# Altium schematic sheet 13.SchDoc
size 513 x 386 mm
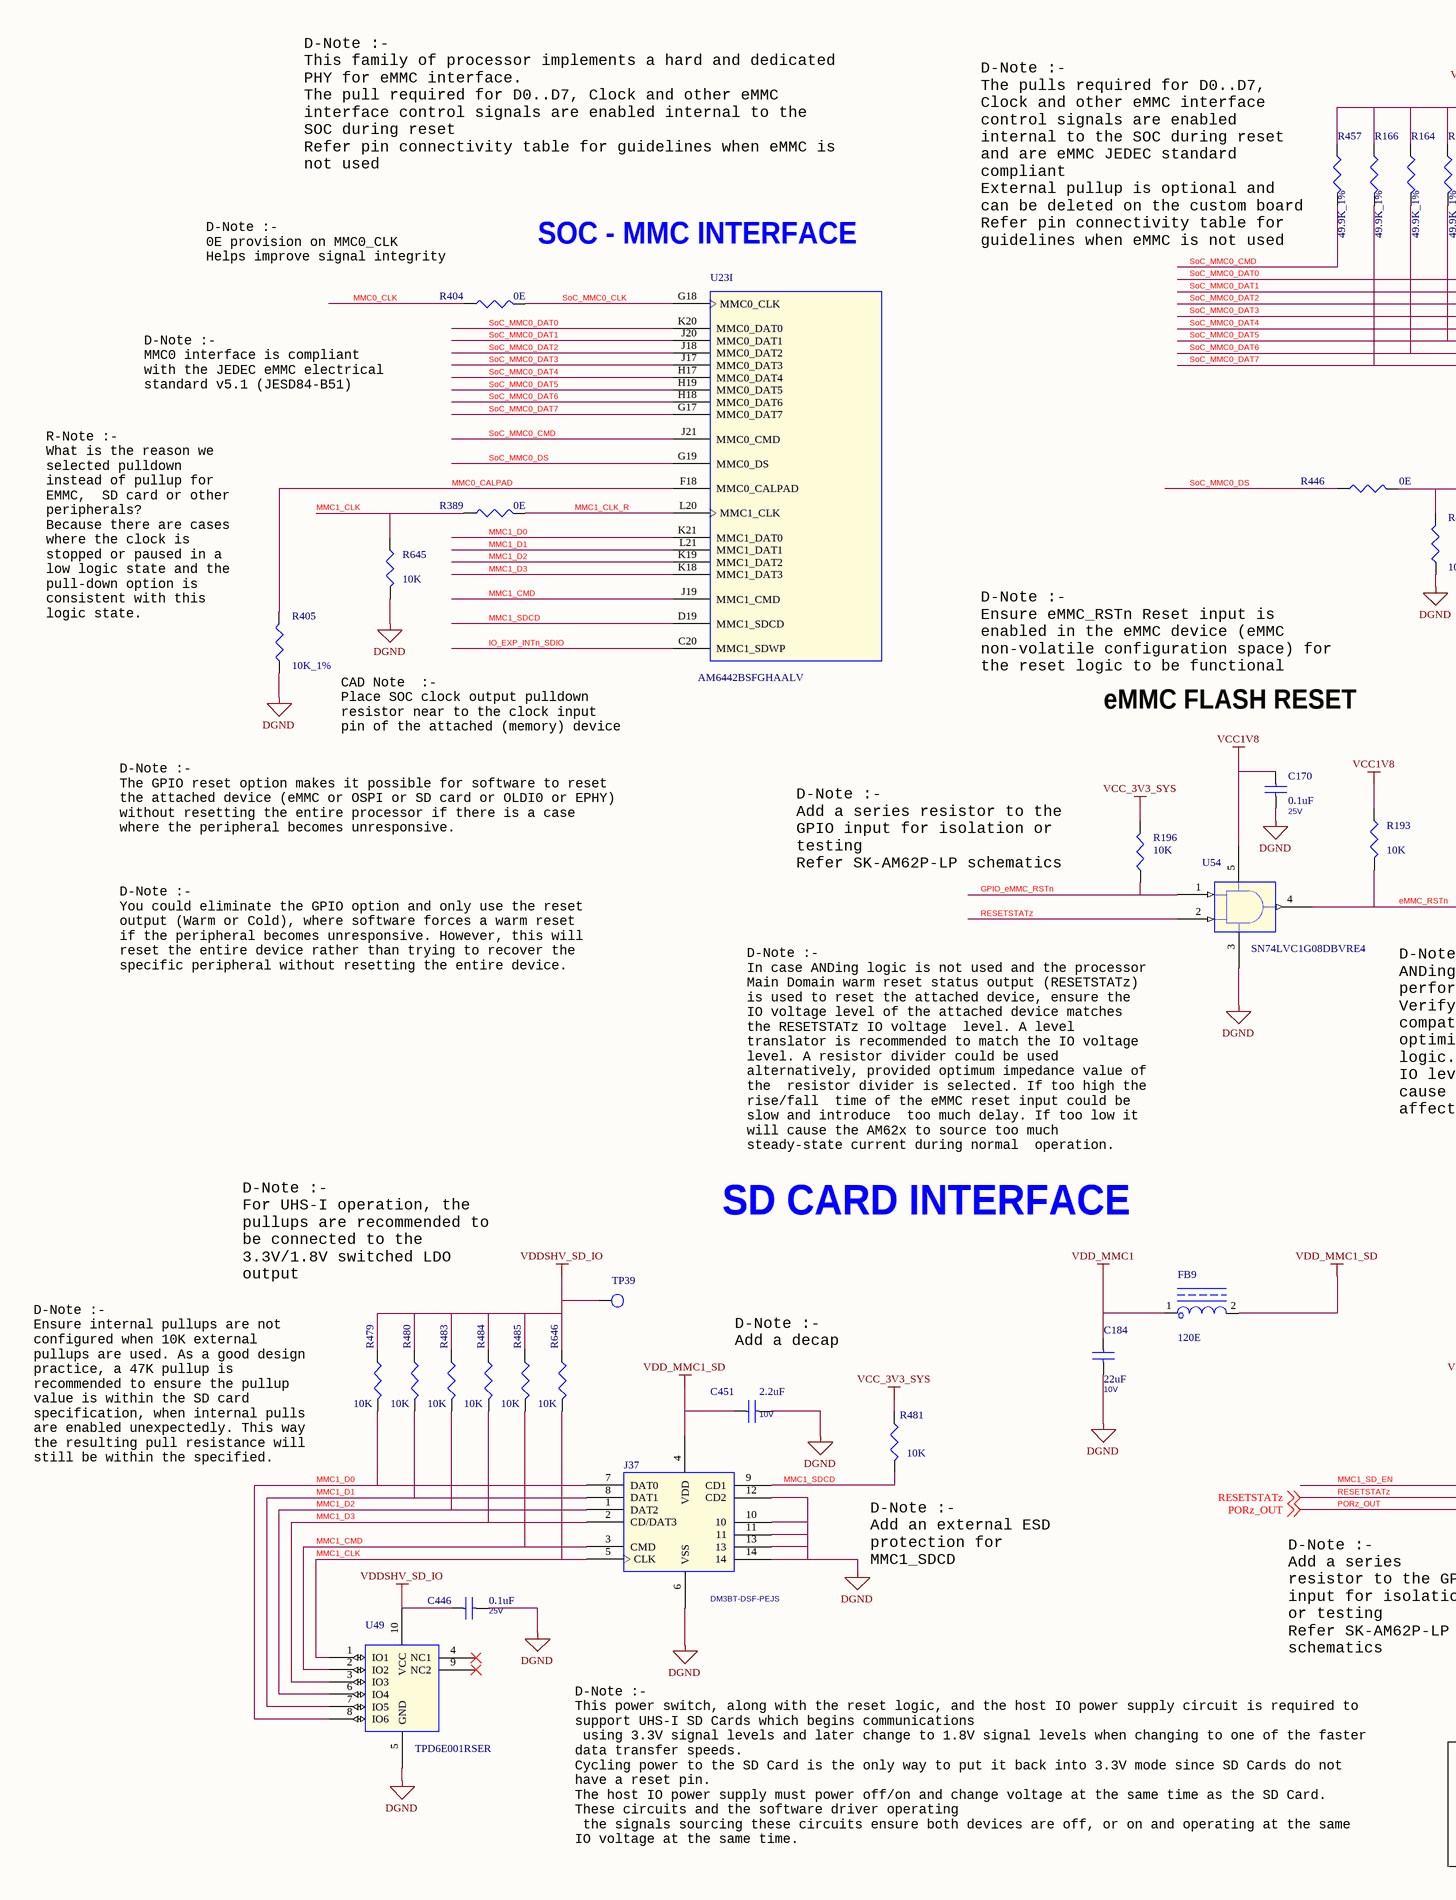
[diagram p0: 13.SchDoc, left]
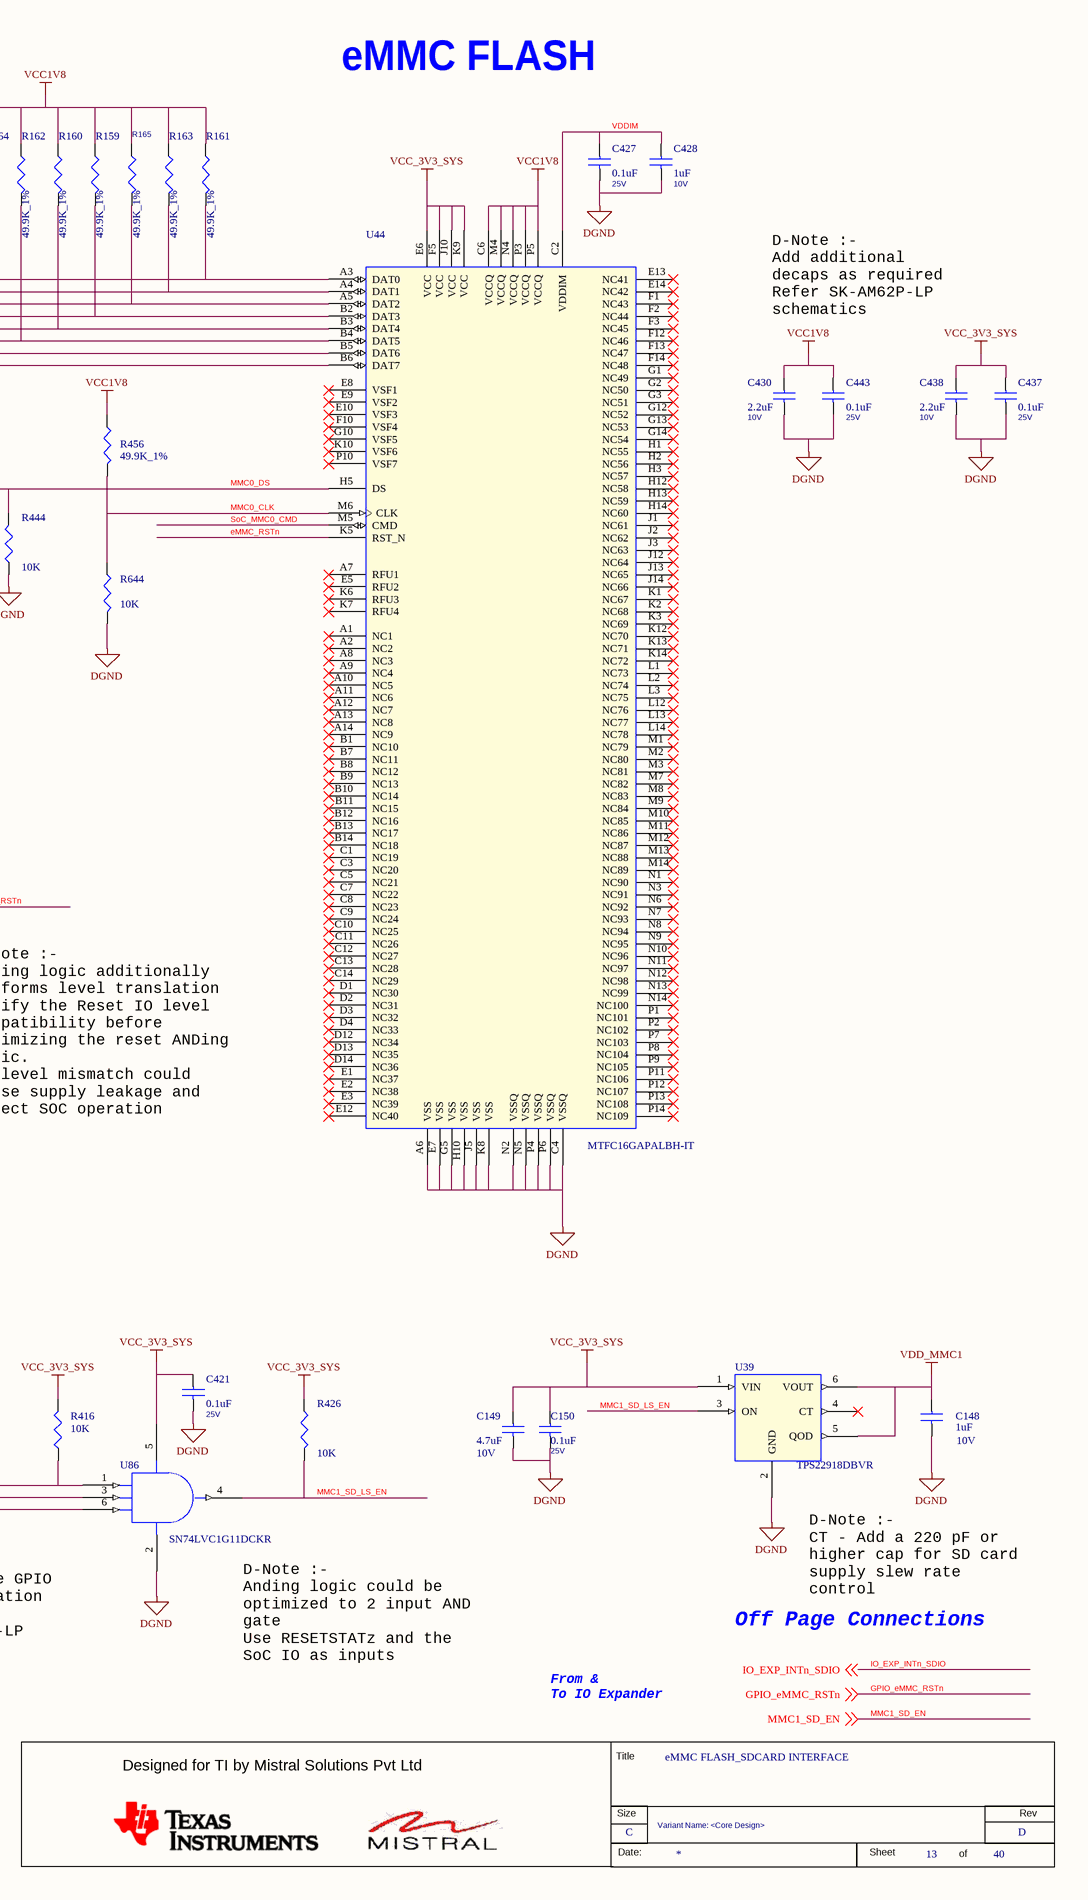
[diagram p1: 13.SchDoc, right]

## Parts
*  RevCode: D  Title: eMMC FLASH_SDCARD INTERFACE  Page Size: C  Page Number: 13  Page Count: 40  Variant Name: <Core Design>  (hidden comment: MISTRAL_TITLEBLK_CSIZE)  (graphical)
C148  1uF  Voltage: 10V  [CAP0402_0-75]
C149  4.7uF  Voltage: 10V  [CAP0402_0-75]
C150  0.1uF  Voltage: 25V  [CAP0402_0-75]
C170  0.1uF  Voltage: 25V  [CAP0402_0-75]
C184  22uF  Voltage: 10V  [CAP0805_1-5]
C421  0.1uF  Voltage: 25V  [CAP0402_0-75]
C427  0.1uF  Voltage: 25V  [CAP0402_0-75]
C428  1uF  Voltage: 10V  [CAP0402_0-75]
C430  2.2uF  Voltage: 10V  [CAP0402_0-75]
C437  0.1uF  Voltage: 25V  [CAP0402_0-75]
C438  2.2uF  Voltage: 10V  [CAP0402_0-75]
C443  0.1uF  Voltage: 25V  [CAP0402_0-75]
C446  0.1uF  Voltage: 25V  [CAP0402_0-75]
C451  2.2uF  Voltage: 10V  [CAP0402_0-75]
FB9  120E  [IND0603_1]
J37  Mfr_part_number: DM3BT-DSF-PEJS  [CON_SD10_DM3BT-DSF-PEJS_S_R_S_2-4]  (hidden comment: CON_SDCARD10_DM3BT-DSF-PEJS)
R159  49.9K_1%  [RES0402_0-5]
R160  49.9K_1%  [RES0402_0-5]
R161  49.9K_1%  [RES0402_0-5]
R162  49.9K_1%  [RES0402_0-5]
R163  49.9K_1%  [RES0402_0-5]
R164  49.9K_1%  [RES0402_0-5]
R165  49.9K_1%  [RES0402_0-5]
R166  49.9K_1%  [RES0402_0-5]
R193  10K  [RES0402_0-5]
R196  10K  [RES0402_0-5]
R389  0E  [RES0402_0-5]
R404  0E  [RES0402_0-5]
R405  10K_1%  [RES0402_0-5]
R416  10K  [RES0402_0-5]
R426  10K  [RES0402_0-5]
R444  10K  [RES0402_0-5]
R446  0E  [RES0402_0-5]
R456  49.9K_1%  [RES0402_0-5]
R457  49.9K_1%  [RES0402_0-5]
R479  10K  [RES0402_0-5]
R480  10K  [RES0402_0-5]
R481  10K  [RES0402_0-5]
R483  10K  [RES0402_0-5]
R484  10K  [RES0402_0-5]
R485  10K  [RES0402_0-5]
R644  10K  [RES0402_0-5]
R645  10K  [RES0402_0-5]
R646  10K  [RES0402_0-5]
TP39  TP20_SMD  [TP20_SMD]  (value not drawn)
U23  AM6442BSFGHAALV  [FCBGA441_31-49_680X680_2-6]  (part I of 16)
U39  TPS22918DBVR  [SOT23-6]
U44  MTFC16GAPALBH-IT  [VFBGA153_19-68_460X520_1-1]
U49  TPD6E001RSER  [UQFN10_19-68_80X60_0-6]
U54  SN74LVC1G08DBVRE4  [SOT23-5]
U86  SN74LVC1G11DCKR  [SC70-6]

## Nets
DGND: C148.2 C149.2 C150.2 C170.2 C184.2 C421.2 C427.2 C428.2 C430.2 C437.2 C438.2 C443.2 C446.2 C451.2 J37.6(VSS) J37.10 J37.11 J37.12(CD2) J37.13 J37.14 R405.2 R444.1 R644.2 R645.2 U39.2(GND) U44.A6(VSS) U44.C4(VSSQ) U44.E7(VSS) U44.G5(VSS) U44.H10(VSS) U44.J5(VSS) U44.K8(VSS) U44.N2(VSSQ) U44.N5(VSSQ) U44.P4(VSSQ) U44.P6(VSSQ) U49.5(GND) U54.3(GND) U86.2(GND)
VCC1V8: C170.1 C430.1 C443.1 R159.1 R160.1 R161.1 R162.1 R163.1 R164.1 R165.1 R166.1 R193.1 R456.1 R457.1 U44.C6(VCCQ) U44.M4(VCCQ) U44.N4(VCCQ) U44.P3(VCCQ) U44.P5(VCCQ) U54.5(VCC)
VCC_3V3_SYS: C149.1 C150.1 C421.1 C437.1 C438.1 R196.2 R416.2 R426.1 R481.1 U39.1(VIN) U44.E6(VCC) U44.F5(VCC) U44.J10(VCC) U44.K9(VCC) U86.5(VCC)
VDD_MMC1: C148.1 C184.1 FB9.1 U39.5(QOD) U39.6(VOUT)
VDD_MMC1_SD: C451.1 FB9.2 J37.4(VDD)
VDDSHV_SD_IO: C446.1 R479.1 R480.1 R483.1 R484.1 R485.1 R646.1 TP39.1(TP) U49.10(VCC)
eMMC_RSTn: R193.2 U44.K5(RST_N) U54.4(Y)
GPIO_eMMC_RSTn: R196.1 U54.1(A) ; off-sheet GPIO_eMMC_RSTn
IO_EXP_INTn_SDIO: U23.C20(MMC1_SDWP) ; off-sheet IO_EXP_INTn_SDIO
MMC0_CALPAD: R405.1 U23.F18(MMC0_CALPAD)
MMC0_CLK: R404.1 R456.2 R644.1 U44.M6(CLK)
MMC0_DS: R444.2 R446.2 U44.H5(DS)
MMC1_CLK: J37.5(CLK) R389.1 R645.1 R646.2 U49.1(IO1)
MMC1_CLK_R: R389.2 U23.L20(MMC1_CLK)
MMC1_CMD: J37.3(CMD) R485.2 U23.J19(MMC1_CMD) U49.2(IO2)
MMC1_D0: J37.7(DAT0) R479.2 U23.K21(MMC1_DAT0) U49.8(IO6)
MMC1_D1: J37.8(DAT1) R480.2 U23.L21(MMC1_DAT1) U49.7(IO5)
MMC1_D2: J37.1(DAT2) R483.2 U23.K19(MMC1_DAT2) U49.6(IO4)
MMC1_D3: J37.2(CD/DAT3) R484.2 U23.K18(MMC1_DAT3) U49.3(IO3)
MMC1_SD_EN: R416.1 U86.1(A) ; off-sheet MMC1_SD_EN
MMC1_SD_LS_EN: R426.2 U39.3(ON) U86.4(Y)
MMC1_SDCD: J37.9(CD1) R481.2 U23.D19(MMC1_SDCD)
PORz_OUT: U86.6(C) ; off-sheet PORz_OUT
RESETSTATz: U54.2(B) U86.3(B) ; off-sheet RESETSTATz
SoC_MMC0_CLK: R404.2 U23.G18(MMC0_CLK)
SoC_MMC0_CMD: R457.2 U23.J21(MMC0_CMD) U44.M5(CMD)
SoC_MMC0_DAT0: R161.2 U23.K20(MMC0_DAT0) U44.A3(DAT0)
SoC_MMC0_DAT1: R163.2 U23.J20(MMC0_DAT1) U44.A4(DAT1)
SoC_MMC0_DAT2: R165.2 U23.J18(MMC0_DAT2) U44.A5(DAT2)
SoC_MMC0_DAT3: R159.2 U23.J17(MMC0_DAT3) U44.B2(DAT3)
SoC_MMC0_DAT4: R160.2 U23.H17(MMC0_DAT4) U44.B3(DAT4)
SoC_MMC0_DAT5: R162.2 U23.H19(MMC0_DAT5) U44.B4(DAT5)
SoC_MMC0_DAT6: R164.2 U23.H18(MMC0_DAT6) U44.B5(DAT6)
SoC_MMC0_DAT7: R166.2 U23.G17(MMC0_DAT7) U44.B6(DAT7)
SoC_MMC0_DS: R446.1 U23.G19(MMC0_DS)
VDDIM: C427.1 C428.1 U44.C2(VDDIM)

Not connected (* = marked no-connect by the designer): U39 4(CT)*; U44 A1(NC1)* A2(NC2)* A7(RFU1)* A8(NC3)* A9(NC4)* A10(NC5)* A11(NC6)* A12(NC7)* A13(NC8)* A14(NC9)* B1(NC10)* B7(NC11)* B8(NC12)* B9(NC13)* B10(NC14)* B11(NC15)* B12(NC16)* B13(NC17)* B14(NC18)* C1(NC19)* C3(NC20)* C5(NC21)* C7(NC22)* C8(NC23)* C9(NC24)* C10(NC25)* C11(NC26)* C12(NC27)* C13(NC28)* C14(NC29)* D1(NC30)* D2(NC31)* D3(NC32)* D4(NC33)* D12(NC34)* D13(NC35)* D14(NC36)* E1(NC37)* E2(NC38)* E3(NC39)* E5(RFU2)* E8(VSF1)* E9(VSF2)* E10(VSF3)* E12(NC40)* E13(NC41)* E14(NC42)* F1(NC43)* F2(NC44)* F3(NC45)* F10(VSF4)* F12(NC46)* F13(NC47)* F14(NC48)* G1(NC49)* G2(NC50)* G3(NC51)* G10(VSF5)* G12(NC52)* G13(NC53)* G14(NC54)* H1(NC55)* H2(NC56)* H3(NC57)* H12(NC58)* H13(NC59)* H14(NC60)* J1(NC61)* J2(NC62)* J3(NC63)* J12(NC64)* J13(NC65)* J14(NC66)* K1(NC67)* K2(NC68)* K3(NC69)* K6(RFU3)* K7(RFU4)* K10(VSF6)* K12(NC70)* K13(NC71)* K14(NC72)* L1(NC73)* L2(NC74)* L3(NC75)* L12(NC76)* L13(NC77)* L14(NC78)* M1(NC79)* M2(NC80)* M3(NC81)* M7(NC82)* M8(NC83)* M9(NC84)* M10(NC85)* M11(NC86)* M12(NC87)* M13(NC88)* M14(NC89)* N1(NC90)* N3(NC91)* N6(NC92)* N7(NC93)* N8(NC94)* N9(NC95)* N10(NC96)* N11(NC97)* N12(NC98)* N13(NC99)* N14(NC100)* P1(NC101)* P2(NC102)* P7(NC103)* P8(NC104)* P9(NC105)* P10(VSF7)* P11(NC106)* P12(NC107)* P13(NC108)* P14(NC109)*; U49 4(NC1)* 9(NC2)*

## Notes on the sheet
- D-Note :-
  This family of processor implements a hard and dedicated
  PHY for eMMC interface.
  The pull required for D0..D7, Clock and other eMMC
  interface control signals are enabled internal to the
  SOC during reset
  Refer pin connectivity table for guidelines when eMMC is
  not used
- (near R457) D-Note :-
  The pulls required for D0..D7,
  Clock and other eMMC interface
  control signals are enabled
  internal to the SOC during reset
  and are eMMC JEDEC standard
  compliant
  External pullup is optional and
  can be deleted on the custom board
  Refer pin connectivity table for
  guidelines when eMMC is not used
- eMMC FLASH
- (near R404) D-Note :-
  0E provision on MMC0_CLK
  Helps improve signal integrity
- D-Note :-
  Add additional
  decaps as required
  Refer SK-AM62P-LP
  schematics
- SOC - MMC INTERFACE
- D-Note :-
  MMC0 interface is compliant
  with the JEDEC eMMC electrical
  standard v5.1 (JESD84-B51)
- (near R405) R-Note :-
  What is the reason we
  selected pulldown
  instead of pullup for
  EMMC,  SD card or other
  peripherals?
  Because there are cases
  where the clock is
  stopped or paused in a
  low logic state and the
  pull-down option is
  consistent with this
  logic state.
- D-Note :-
  Ensure eMMC_RSTn Reset input is
  enabled in the eMMC device (eMMC
  non-volatile configuration space) for
  the reset logic to be functional
- CAD Note  :-
  Place SOC clock output pulldown
  resistor near to the clock input
  pin of the attached (memory) device
- eMMC FLASH RESET
- D-Note :-
  The GPIO reset option makes it possible for software to reset
  the attached device (eMMC or OSPI or SD card or OLDI0 or EPHY)
  without resetting the entire processor if there is a case
  where the peripheral becomes unresponsive.
- D-Note :-
  Add a series resistor to the
  GPIO input for isolation or
  testing
  Refer SK-AM62P-LP schematics
- D-Note :-
  You could eliminate the GPIO option and only use the reset
  output (Warm or Cold), where software forces a warm reset
  if the peripheral becomes unresponsive. However, this will
  reset the entire device rather than trying to recover the
  specific peripheral without resetting the entire device.
- (near U54) D-Note :-
  In case ANDing logic is not used and the processor
  Main Domain warm reset status output (RESETSTATz)
  is used to reset the attached device, ensure the
  IO voltage level of the attached device matches
  the RESETSTATz IO voltage  level. A level
  translator is recommended to match the IO voltage
  level. A resistor divider could be used
  alternatively, provided optimum impedance value of
  the  resistor divider is selected. If too high the
  rise/fall  time of the eMMC reset input could be
  slow and introduce  too much delay. If too low it
  will cause the AM62x to source too much
  steady-state current during normal  operation.
- D-Note :-
  ANDing logic additionally
  performs level translation
  Verify the Reset IO level
  compatibility before
  optimizing the reset ANDing
  logic.
  IO level mismatch could
  cause supply leakage and
  affect SOC operation
- D-Note :-
  For UHS-I operation, the
  pullups are recommended to
  be connected to the
  3.3V/1.8V switched LDO
  output
- SD CARD INTERFACE
- (near R479) D-Note :-
  Ensure internal pullups are not
  configured when 10K external
  pullups are used. As a good design
  practice, a 47K pullup is
  recommended to ensure the pullup
  value is within the SD card
  specification, when internal pulls
  are enabled unexpectedly. This way
  the resulting pull resistance will
  still be within the specified.
- D-Note :-
  Add a decap
- (near R481) D-Note :-
  Add an external ESD
  protection for
  MMC1_SDCD
- D-Note :-
  Add a series
  resistor to the GPIO
  input for isolation
  or testing
  Refer SK-AM62P-LP
  schematics
- D-Note :-
  CT - Add a 220 pF or
  higher cap for SD card
  supply slew rate
  control
- (near U86) D-Note :-
  Anding logic could be
  optimized to 2 input AND
  gate
  Use RESETSTATz and the
  SoC IO as inputs
- Off Page Connections
- (near *) D-Note :-
  This power switch, along with the reset logic, and the host IO power supply circuit is required to
  support UHS-I SD Cards which begins communications
  using 3.3V signal levels and later change to 1.8V signal levels when changing to one of the faster
  data transfer speeds.
  Cycling power to the SD Card is the only way to put it back into 3.3V mode since SD Cards do not
  have a reset pin.
  The host IO power supply must power off/on and change voltage at the same time as the SD Card.
  These circuits and the software driver operating
  the signals sourcing these circuits ensure both devices are off, or on and operating at the same
  IO voltage at the same time.
- From &
  To IO Expander
- (in symbol MISTRAL_TITLEBLK_CSIZE) Title; Designed for TI by Mistral Solutions Pvt Ltd; Size; Rev; Date:; Sheet; of

## Library data of the parts
* = MISTRAL_TITLEBLK_CSIZE: Issue: 1.0; Page Create Date: March  8, 1995; Page Modify Date: *
C148 = CAP_Dup3: CAP CERAMIC 1uF 10V 20% X5R 0402; Part_type: CAPACITORS\CERAMIC; Mfr_part_number: 885012105012; Mfr_name: WURTH ELECTRONICS; Mistral Part No: 120020080009-R; Custom_Duty: 15%; Customs_HS_Code: 85322990; Wattage: NA; Project: AM64x_EVM_BRD; PCB Footprint: CAP0402_0-75; Footprint Path: Y:\MIS_DATABASE\Library\ALTIUM_TOOL\PCB_FOOTPRINTS\Altium_Footprint_Lib.PcbLib; Library Path: Y:\MIS_DATABASE\Library\ALTIUM_TOOL\SCHEMATICS_PARTS\MS_DISCRETE_Library.schlib; Footprint Ref: CAP0402_0-75; Library Ref: CAP; MECHANICAL 3D STEP FILE: CAP0402_0-75; Chkd/date: MANIRAJA/210820; Crtd /date: ALVY/190820; Datasheet: Y:\MIS_DATABASE\DATASHEETS\CAPACITORS\885012105012.PDF; Temperature: -55癈+85癈; Weight: 0.65mg; Height: 0.55MM; Distributor_part_number: 732-7489-1-ND; Distributor_name: DIGIKEY; Package: 0402; Tolerance: 20%
C149 = CAP_Dup3: CAP CERAMIC 4.7uF 10V 20% X5R 0402; Mistral Part No: 120012060002-R; Mfr_name: MURATA; Mfr_part_number: GRM155R61A475MEAAD; Part_type: CAPACITORS\CERAMIC; Project: TI_J7SVB_PCIE_ADD-ON-CARD; Wattage: NA; Customs_HS_Code: 85322990; Custom_Duty: 15%; PCB Footprint: CAP0402_0-75; Footprint Ref: CAP0402_0-75; Tolerance: 20%; Package: 0402; Distributor_name: DIGIKEY; Distributor_part_number: 490-14306-1-ND; Library Ref: CAP; Height: 0.65MM; Weight: 14mg; Temperature: -55癈+85癈; Datasheet: Y:\MIS_DATABASE\DATASHEETS\CAPACITORS\GRM155R61A475MEAAD.PDF; Crtd /date: ALVY/110718; Chkd/date: MANIRAJA/110718; MECHANICAL 3D STEP FILE: CAP0402_0-75; Library Path: Y:\MIS_DATABASE\Library\ALTIUM_TOOL\SCHEMATICS_PARTS\MS_DISCRETE_Library.schlib; Footprint Path: Y:\MIS_DATABASE\Library\ALTIUM_TOOL\PCB_FOOTPRINTS\Altium_Footprint_Lib.PcbLib
C150 C170 C421 C427 C437 C443 C446 = CAP_Dup3: CAP CERAMIC 0.1uF 25V 20% X5R 0402; Alt_Mfr_part_number: CC0402KRX5R8BB104; Mistral Part No: 120020080003-R; Mfr_name: WURTH ELECTRONICS; Mfr_part_number: 885012105018; Part_type: CAPACITORS\CERAMIC; Alt_Mfr_name: YAGEO AMERICA; Project: AM64x_EVM_BRD; Wattage: NA; Customs_HS_Code: 85322990; Custom_Duty: 15%; PCB Footprint: CAP0402_0-75; Tolerance: 20%; Package: 0402; Distributor_name: DIGIKEY; Distributor_part_number: 732-7495-1-ND; Height: 0.55MM; Weight: 0.65mg; Temperature: -55癈+85癈; Datasheet: Y:\MIS_DATABASE\DATASHEETS\CAPACITORS\885012105018.PDF; Crtd /date: ALVY/170820; Chkd/date: MANIRAJA/170820; MECHANICAL 3D STEP FILE: CAP0402_0-75; Library Ref: CAP; Footprint Ref: CAP0402_0-75; Library Path: Y:\MIS_DATABASE\Library\ALTIUM_TOOL\SCHEMATICS_PARTS\MS_DISCRETE_Library.schlib; Footprint Path: Y:\MIS_DATABASE\Library\ALTIUM_TOOL\PCB_FOOTPRINTS\Altium_Footprint_Lib.PcbLib
C184 = CAP_Dup3: CAP CERAMIC 22uF 10V 20% X5R 0805; Mistral Part No: 120020080010-R; Mfr_name: WURTH ELECTRONICS; Mfr_part_number: 885012107011; Part_type: CAPACITORS\CERAMIC; Project: AM64x_EVM_BRD; Wattage: NA; Customs_HS_Code: 85322990; Custom_Duty: 15%; PCB Footprint: CAP0805_1-5; Footprint Path: Y:\MIS_DATABASE\Library\ALTIUM_TOOL\PCB_FOOTPRINTS\Altium_Footprint_Lib.PcbLib; Library Path: Y:\MIS_DATABASE\Library\ALTIUM_TOOL\SCHEMATICS_PARTS\MS_DISCRETE_Library.schlib; Footprint Ref: CAP0805_1-5; Tolerance: 20%; Package: 0805; Distributor_name: DIGIKEY; Distributor_part_number: 732-7621-1-ND; Library Ref: CAP; Height: 1.45MM; Weight: 5.5mg; Temperature: -55癈+85癈; Datasheet: Y:\MIS_DATABASE\DATASHEETS\CAPACITORS\885012107011.PDF; Crtd /date: ALVY/190820; Chkd/date: MANIRAJA/210820; MECHANICAL 3D STEP FILE: CAP0805_1-5
C428 = CAP_Dup3: CAP CERAMIC 1uF 10V 20% X5R 0402; Part_type: CAPACITORS\CERAMIC; Mfr_part_number: 885012105012; Mfr_name: WURTH ELECTRONICS; Mistral Part No: 120020080009-R; Custom_Duty: 15%; Customs_HS_Code: 85322990; Project: AM64x_EVM_BRD; Wattage: NA; PCB Footprint: CAP0402_0-75; Footprint Ref: CAP0402_0-75; Library Ref: CAP; Chkd/date: MANIRAJA/210820; Crtd /date: ALVY/190820; Datasheet: Y:\MIS_DATABASE\DATASHEETS\CAPACITORS\885012105012.PDF; Temperature: -55癈+85癈; Weight: 0.65mg; Height: 0.55MM; Distributor_part_number: 732-7489-1-ND; Distributor_name: DIGIKEY; Package: 0402; Tolerance: 20%; MECHANICAL 3D STEP FILE: CAP0402_0-75; Library Path: Y:\MIS_DATABASE\Library\ALTIUM_TOOL\SCHEMATICS_PARTS\MS_DISCRETE_Library.schlib; Footprint Path: Y:\MIS_DATABASE\Library\ALTIUM_TOOL\PCB_FOOTPRINTS\Altium_Footprint_Lib.PcbLib
C430 C438 C451 = CAP_Dup3: CAP CERAMIC 2.2uF 10V 20% X5R 0402; Mistral Part No: 120019040036-R; Mfr_name: WURTH ELECTRONICS; Mfr_part_number: 885012105013; Part_type: CAPACITORS\CERAMIC; Project: AM64x_EVM_BRD; Wattage: NA; Customs_HS_Code: 85322990; Custom_Duty: 15%; PCB Footprint: CAP0402_0-75; Library Ref: CAP; Tolerance: 20%; Package: 0402; Distributor_name: DIGIKEY; Distributor_part_number: 732-7490-1-ND; Height: 0.55MM; Weight: 0.65mg; Temperature: -55癈+85癈; Datasheet: Y:\MIS_DATABASE\DATASHEETS\CAPACITORS\885012105013.PDF; Crtd /date: ALVY/170820; Chkd/date: MANIRAJA/170820; MECHANICAL 3D STEP FILE: CAP0402_0-75; Footprint Ref: CAP0402_0-75; Library Path: Y:\MIS_DATABASE\Library\ALTIUM_TOOL\SCHEMATICS_PARTS\MS_DISCRETE_Library.schlib; Footprint Path: Y:\MIS_DATABASE\Library\ALTIUM_TOOL\PCB_FOOTPRINTS\Altium_Footprint_Lib.PcbLib
FB9 = INDUCTOR_FERRITE: IND FERRITE BEAD CHIP 120E 2A 0603; Mfr_part_number: 782631141; Mfr_name: WURTH ELECTRONICS; Mistral Part No: 130020080015-R; Custom_Duty: 24%; Customs_HS_Code: 85437099; Wattage: NA; Tolerance: 25%; Project: AM64x_EVM_BRD; PCB Footprint: IND0603_1; Footprint Path: Y:\MIS_DATABASE\Library\ALTIUM_TOOL\PCB_FOOTPRINTS\Altium_Footprint_Lib.PcbLib; Library Path: Y:\MIS_DATABASE\Library\ALTIUM_TOOL\SCHEMATICS_PARTS\MS_FILTER_Library.schlib; MECHANICAL 3D STEP FILE: IND0603_1; Chkd/date: MANIRAJA/180820; Crtd /date: ALVY/180820; Datasheet: Y:\MIS_DATABASE\DATASHEETS\DISCRETES\INDUCTORS\782631141.PDF; Temperature: -55癈+125癈; Weight: NA; Height: 1.00MM; Library Ref: INDUCTOR_FERRITE; Distributor_part_number: 732-782631141CT-ND; Distributor_name: DIGIKEY; Package: 0603; Voltage: NA; Part_type: INDUCTOR; Footprint Ref: IND0603_1
J37 = CON_SDCARD_10_DM3BT-DSF-PEJS: CON MICROSD CARD PUSH-PUSH 10POS FEMALE RM RA SMD; Mistral Part No: 150011010020-R; Mfr_name: HIROSE ELECTRIC; Part_type: CONNECTOR\MEMORY CARD; Project: EBOOK; Tolerance: NA; Customs_HS_Code: 85369090; Custom_Duty: 24%; PCB Footprint: CON_SD10_DM3BT-DSF-PEJS_S_R_S_2-4; Footprint Ref: CON_SD10_DM3BT-DSF-PEJS_S_R_S_2-4; Voltage: NA; Wattage: NA; Package: SMD; Distributor_name: DIGIKEY; Distributor_part_number: HR1942CT-ND; Library Ref: CON_SDCARD_10_DM3BT-DSF-PEJS; Height: 2.38MM; Weight: 1.315g; Temperature: -25癈+85癈; Datasheet: Y:\MIS_DATABASE\DATASHEETS\CONNECTORS\DM3-SERIES.PDF; Crtd /date: BAVISH/190111; Chkd/date: MANIRAJA/080218; MECHANICAL 3D STEP FILE: CON_SD10_DM3BT-DSF-PEJS_S_R_S_2-4; Library Path: Y:\MIS_DATABASE\Library\ALTIUM_TOOL\SCHEMATICS_PARTS\MS_CONNECTOR_Library.schlib; Footprint Path: Y:\MIS_DATABASE\Library\ALTIUM_TOOL\PCB_FOOTPRINTS\Altium_Footprint_Lib.PcbLib
R159-R164 R166 R456 R457 = RESISTOR_Dup6: RES 49.9K 1/16W 1% 0402; Part_type: RESISTORS\FIXED; Mfr_part_number: RC0402FR-0749K9L; Mfr_name: YAGEO AMERICA; Mistral Part No: 110009030902-R; Voltage: NA; Custom_Duty: 15%; Customs_HS_Code: 85332119; Project: PNAV; Footprint Path: Y:\MIS_DATABASE\Library\ALTIUM_TOOL\PCB_FOOTPRINTS\Altium_Footprint_Lib.PcbLib; Library Path: Y:\MIS_DATABASE\Library\ALTIUM_TOOL\SCHEMATICS_PARTS\MS_DISCRETE_Library.schlib; MECHANICAL 3D STEP FILE: RES0402_0-5; Temperature: -55癈+155癈; Weight: 0.65mg; Footprint Ref: RES0402_0-5; Chkd/date: MAZHAR/220709; Crtd /date: GEETHA/090606; Datasheet: Y:\MIS_DATABASE\DATASHEETS\RESISTORS\RCXXXXL-SER_MAR18.PDF; Height: 0.40MM; Distributor_part_number: 311-49.9KLRCT-ND; Distributor_name: DIGIKEY; Package: 0402; Wattage: 1/16W; Tolerance: 1%; Library Ref: RESISTOR; PCB Footprint: RES0402_0-5
R165 = RESISTOR_Dup6: RES 49.9K 1/16W 1% 0402; Mistral Part No: 110009030902-R; Mfr_name: YAGEO AMERICA; Mfr_part_number: RC0402FR-0749K9L; Part_type: RESISTORS\FIXED; Project: PNAV; Customs_HS_Code: 85332119; Custom_Duty: 15%; Voltage: NA; Library Ref: RESISTOR; Tolerance: 1%; Wattage: 1/16W; Package: 0402; Distributor_name: DIGIKEY; Distributor_part_number: 311-49.9KLRCT-ND; Height: 0.40MM; Datasheet: Y:\MIS_DATABASE\DATASHEETS\RESISTORS\RCXXXXL-SER_MAR18.PDF; Crtd /date: GEETHA/090606; Chkd/date: MAZHAR/220709; Footprint Ref: RES0402_0-5; Weight: 0.65mg; Temperature: -55癈+155癈; MECHANICAL 3D STEP FILE: RES0402_0-5; Library Path: Y:\MIS_DATABASE\Library\ALTIUM_TOOL\SCHEMATICS_PARTS\MS_DISCRETE_Library.schlib; Footprint Path: Y:\MIS_DATABASE\Library\ALTIUM_TOOL\PCB_FOOTPRINTS\Altium_Footprint_Lib.PcbLib; PCB Footprint: RES0402_0-5
R193 R196 R426 R444 R479-R481 R483-R485 R644 R645 = RESISTOR_Dup6: RES 10K 1/16W 5% 0402; Mistral Part No: 110011060021-R; Mfr_name: YAGEO AMERICA; Mfr_part_number: RC0402JR-0710KL; Part_type: RESISTORS\FIXED; Project: HSE; Voltage: NA; Customs_HS_Code: 85332119; Custom_Duty: 15%; Footprint Path: Y:\MIS_DATABASE\Library\ALTIUM_TOOL\PCB_FOOTPRINTS\Altium_Footprint_Lib.PcbLib; Library Path: Y:\MIS_DATABASE\Library\ALTIUM_TOOL\SCHEMATICS_PARTS\MS_DISCRETE_Library.schlib; Footprint Ref: RES0402_0-5; Library Ref: RESISTOR; Tolerance: 5%; Wattage: 1/16W; Package: 0402; Distributor_name: DIGIKEY; Distributor_part_number: 311-10KJRCT-ND; Height: 0.40MM; Weight: 0.65mg; Temperature: -55癈+155癈; Datasheet: Y:\MIS_DATABASE\DATASHEETS\RESISTORS\RCXXXXL-SER_MAR18.PDF; Crtd /date: MAZHAR/230805; Chkd/date: VASANTHA/061216; MECHANICAL 3D STEP FILE: RES0402_0-5; PCB Footprint: RES0402_0-5
R389 = RESISTOR_Dup6: RES 0E 1/16W JUMPER 0402; Part_type: RESISTORS\FIXED; Mfr_part_number: CRCW04020000Z0ED; Mfr_name: VISHAY; Mistral Part No: 110010080019-R; Custom_Duty: 15%; Customs_HS_Code: 85332119; Voltage: NA; Project: PB_BUGBASE; PCB Footprint: RES0402_0-5; Footprint Path: Y:\MIS_DATABASE\Library\ALTIUM_TOOL\PCB_FOOTPRINTS\Altium_Footprint_Lib.PcbLib; Library Path: Y:\MIS_DATABASE\Library\ALTIUM_TOOL\SCHEMATICS_PARTS\MS_DISCRETE_Library.schlib; MECHANICAL 3D STEP FILE: RES0402_0-5; Footprint Ref: RES0402_0-5; Chkd/date: VASANTHA/201216; Crtd /date: MUDDU/190810; Datasheet: Y:\MIS_DATABASE\DATASHEETS\RESISTORS\CRCW0603.PDF; Temperature: -55癈+155癈; Weight: 0.65mg; Height: 0.40MM; Distributor_part_number: 541-0.0JCT-ND; Distributor_name: DIGIKEY; Package: 0402; Wattage: 1/16W; Tolerance: NA; Library Ref: RESISTOR
R404 = RESISTOR_Dup5: RES 0E 1/16W JUMPER 0402; Part_type: RESISTORS\FIXED; Mfr_part_number: CRCW04020000Z0ED; Mfr_name: VISHAY; Mistral Part No: 110010080019-R; Custom_Duty: 15%; Customs_HS_Code: 85332119; Voltage: NA; Project: PB_BUGBASE; SIGNAL_MODEL: RESISTOR_RES0402_22E_22E; PCB Footprint: RES0402_0-5; Library Ref: RESISTOR; Chkd/date: VASANTHA/201216; Crtd /date: MUDDU/190810; Datasheet: Y:\MIS_DATABASE\DATASHEETS\RESISTORS\CRCW0603.PDF; Temperature: -55癈+155癈; Weight: 0.65mg; Height: 0.40MM; Distributor_part_number: 541-0.0JCT-ND; Distributor_name: DIGIKEY; Package: 0402; Wattage: 1/16W; Tolerance: NA; Footprint Ref: RES0402_0-5; MECHANICAL 3D STEP FILE: RES0402_0-5; Library Path: Y:\MIS_DATABASE\Library\ALTIUM_TOOL\SCHEMATICS_PARTS\MS_DISCRETE_Library.schlib; Footprint Path: Y:\MIS_DATABASE\Library\ALTIUM_TOOL\PCB_FOOTPRINTS\Altium_Footprint_Lib.PcbLib
R405 = RESISTOR_Dup6: RES 10K 1/16W 1% 0402; Mistral Part No: 110015090015-R; Mfr_name: YAGEO AMERICA; Mfr_part_number: RC0402FR-0710KL; Part_type: RESISTORS\FIXED; Project: VOCERA; Voltage: NA; Customs_HS_Code: 85332119; Custom_Duty: 15%; PCB Footprint: RES0402_0-5; Tolerance: 1%; Wattage: 1/16W; Package: 0402; Distributor_name: DIGIKEY; Distributor_part_number: 311-10.0KLRTR-ND; Height: 0.40MM; Weight: 0.65mg; Temperature: -55癈+155癈; Datasheet: Y:\MIS_DATABASE\DATASHEETS\RESISTORS\RCXXXXL-SER_MAR18.PDF; Crtd /date: GEETHA/290506; Chkd/date: VASANTHA/201216; MECHANICAL 3D STEP FILE: RES0402_0-5; Library Ref: RESISTOR; Footprint Ref: RES0402_0-5; Library Path: Y:\MIS_DATABASE\Library\ALTIUM_TOOL\SCHEMATICS_PARTS\MS_DISCRETE_Library.schlib; Footprint Path: Y:\MIS_DATABASE\Library\ALTIUM_TOOL\PCB_FOOTPRINTS\Altium_Footprint_Lib.PcbLib
R416 R646 = RESISTOR_Dup6: RES 10K 1/16W 5% 0402; Part_type: RESISTORS\FIXED; Mfr_part_number: RC0402JR-0710KL; Mfr_name: YAGEO AMERICA; Mistral Part No: 110011060021-R; Custom_Duty: 15%; Customs_HS_Code: 85332119; Voltage: NA; Project: HSE; Footprint Path: Y:\MIS_DATABASE\Library\ALTIUM_TOOL\PCB_FOOTPRINTS\Altium_Footprint_Lib.PcbLib; Library Path: Y:\MIS_DATABASE\Library\ALTIUM_TOOL\SCHEMATICS_PARTS\MS_DISCRETE_Library.schlib; Footprint Ref: RES0402_0-5; Library Ref: RESISTOR; MECHANICAL 3D STEP FILE: RES0402_0-5; Chkd/date: VASANTHA/061216; Crtd /date: MAZHAR/230805; Datasheet: Y:\MIS_DATABASE\DATASHEETS\RESISTORS\RCXXXXL-SER_MAR18.PDF; Temperature: -55癈+155癈; Weight: 0.65mg; Height: 0.40MM; Distributor_part_number: 311-10KJRCT-ND; Distributor_name: DIGIKEY; Package: 0402; Wattage: 1/16W; Tolerance: 5%; PCB Footprint: RES0402_0-5
R446 = RESISTOR_Dup6: RES 0E 1/16W JUMPER 0402; Mistral Part No: 110010080019-R; Mfr_name: VISHAY; Mfr_part_number: CRCW04020000Z0ED; Part_type: RESISTORS\FIXED; Project: PB_BUGBASE; Tolerance: NA; Customs_HS_Code: 85332119; Custom_Duty: 15%; Footprint Path: Y:\MIS_DATABASE\Library\ALTIUM_TOOL\PCB_FOOTPRINTS\Altium_Footprint_Lib.PcbLib; Library Path: Y:\MIS_DATABASE\Library\ALTIUM_TOOL\SCHEMATICS_PARTS\MS_DISCRETE_Library.schlib; Footprint Ref: RES0402_0-5; Library Ref: RESISTOR; Voltage: NA; Wattage: 1/16W; Package: 0402; Distributor_name: DIGIKEY; Distributor_part_number: 541-0.0JCT-ND; Height: 0.40MM; Weight: 0.65mg; Temperature: -55癈+155癈; Datasheet: Y:\MIS_DATABASE\DATASHEETS\RESISTORS\CRCW0603.PDF; Crtd /date: MUDDU/190810; Chkd/date: VASANTHA/201216; MECHANICAL 3D STEP FILE: RES0402_0-5; PCB Footprint: RES0402_0-5
TP39 = TESTPOINT: TESTPOINT CIR 20 SMD; Mistral Part No: NA; Mfr_name: LOCAL; Project: BT MODULE_CSRBC04; PCB Footprint: TP20_SMD; Mfr_part_number: TP20_SMD; Part_type: TESTPOINT; Package: SMD; Distributor_name: NA; Distributor_part_number: NA; Height: NA; Crtd /date: MAZHAR/171006; Chkd/date: SHREESHAIL/171006; Tolerance: NA; Voltage: NA; Wattage: NA; Weight: NA; Temperature: NA; Datasheet: NA; MECHANICAL 3D STEP FILE: NA; Library Path: Y:\MIS_DATABASE\Library\ALTIUM_TOOL\SCHEMATICS_PARTS\MS_DISCRETE_Library.schlib; Footprint Path: Y:\MIS_DATABASE\Library\ALTIUM_TOOL\PCB_FOOTPRINTS\Altium_Footprint_Lib.PcbLib; Library Ref: TESTPOINT; Footprint Ref: TP20_SMD; RoHS: NA; Customs_HS_Code: NA; Custom_Duty: NA
U23 = XAM6442BSFGGAALV_BGA441: IC AM64x SoC MICROPROCESSOR BGA441; Part_type: ICS\DIGITAL\MICROPROCESSOR; Mfr_name: TEXAS INSTRUMENTS; Mistral Part No: 141220080002; Custom_Duty: 15%; Customs_HS_Code: 85423100; Wattage: NA; Project: AM64x-GP_EVM BRD; PCB Footprint: FCBGA441_31-49_680X680_2-6; Footprint Path: Y:\MIS_DATABASE\Library\ALTIUM_TOOL\PCB_FOOTPRINTS\Altium_Footprint_Lib.PcbLib; Library Path: Y:\MIS_DATABASE\Library\ALTIUM_TOOL\SCHEMATICS_PARTS\MS_MICROPROCESSOR_Library.schlib; MECHANICAL 3D STEP FILE: FCBGA441_31-49_680X680_2-6; RoHS: NA; Chkd/date: ALVY/300322; Crtd /date: ALVY/300322; Datasheet: Y:\MIS_DATABASE\DATASHEETS\ICS\DIGITAL\MICROCONTROLLER\AM64-SoC_SVB.PDF; Temperature: NA; Weight: NA; Height: 2.57MM; Library Ref: XAM6442BSFGGAALV_BGA441; Distributor_part_number: NA; Distributor_name: NA; Package: BGA441; Voltage: NA; Tolerance: NA; Mfr_part_number: AM6442BSFGHAALV; Footprint Ref: FCBGA441_31-49_680X680_2-6
U39 = TPS22918DBVR_SOT23-6: IC ON RESISTANCE LOAD SWITCH SOT23-6; Automotive Alternate_mfr_part_number: TPS22918TDBVRQ1; Automotive Alternate_mfr_name: TEXAS INSTRUMENTS; Mistral Part No: 142016050007-R; Part_type: ICS\POWER; Project: TMDXCSK8127; Tolerance: NA; Customs_HS_Code: 85423100; Custom_Duty: 15%; PCB Footprint: SOT23-6; Mfr_name: TEXAS INSTRUMENTS; Mfr_part_number: TPS22918DBVR; Voltage: NA; Wattage: NA; Package: SOT23-6; Distributor_name: DIGIKEY; Distributor_part_number: TPS22918DBVR-ND; Library Ref: TPS22918DBVR_SOT23-6; Height: 1.45MM; Weight: NA; Temperature: -40癈 to 105癈; Datasheet: Y:\MIS_DATABASE\DATASHEETS\ICS\POWER\TPS22918DBV.PDF; Crtd /date: VASANTHA/130516; Chkd/date: VASANTHA/130516
U44 = MTFC16GAPALBH_TFBGA153: IC 16GB e-MMC MEMORY TFBGA153; Mistral Part No: 141120020001-R; Mfr_name: MICRON; Part_type: ICS\DIGITAL\MEMORY; Project: TI_MAXIE_CPB; Tolerance: NA; Customs_HS_Code: 85423100; Custom_Duty: 15%; Footprint Ref: VFBGA153_19-68_460X520_1-1; Mfr_part_number: MTFC16GAPALBH-IT; Voltage: NA; Wattage: NA; Package: TFBGA153; Distributor_name: DIGIKEY; Distributor_part_number: MTFC16GAPALBH-IT-ND; Library Ref: MTFC16GAPALBH_TFBGA153; Height: 1.10MM; Weight: NA; Temperature: -40癈+85癈; Datasheet: Y:\MIS_DATABASE\DATASHEETS\ICS\MEMORY\MTFCXX-IT.PDF; Crtd /date: ALVY/070220; Chkd/date: MANIRAJA/070220; MECHANICAL 3D STEP FILE: VFBGA153_19-68_460X520_1-1; Library Path: Y:\MIS_DATABASE\Library\ALTIUM_TOOL\SCHEMATICS_PARTS\MS_MISCMEMORY_Library.schlib; Footprint Path: Y:\MIS_DATABASE\Library\ALTIUM_TOOL\PCB_FOOTPRINTS\Altium_Footprint_Lib.PcbLib; PCB Footprint: VFBGA153_19-68_460X520_1-1
U49 = TPD6E001RSE_UQFN10: IC 6CH ESD-PROTECTION ARRAY UQFN10; Part_type: ICS\INTERFACE; Mfr_name: TEXAS INSTRUMENTS; Mistral Part No: 141011080020-R; IBISSP_MODLES: Y:\MIS_DATABASE\IBIS\ICs\INTERFACE\TPD6E001RSE.IBS; Custom_Duty: 15%; Customs_HS_Code: 85423100; Wattage: NA; Project: DM385EVM_BASE-BOARD; PCB Footprint: UQFN10_19-68_80X60_0-6; MECHANICAL 3D STEP FILE: UQFN10_19-68_80X60_0-6; Chkd/date: USMAN/070612; Crtd /date: BAVISH/160811; Datasheet: Y:\MIS_DATABASE\DATASHEETS\ICS\INTERFACE\TPD6E001.PDF; Temperature: -40癈+85癈; Weight: 7mg; Height: 0.60MM; Distributor_part_number: 296-21888-1-ND; Distributor_name: DIGIKEY; Package: UQFN10; Voltage: NA; Tolerance: NA; Mfr_part_number: TPD6E001RSER; Library Ref: TPD6E001RSE_UQFN10; Footprint Ref: UQFN10_19-68_80X60_0-6; Library Path: Y:\MIS_DATABASE\Library\ALTIUM_TOOL\SCHEMATICS_PARTS\MS_MISCINTERFACE_Library.schlib; Footprint Path: Y:\MIS_DATABASE\Library\ALTIUM_TOOL\PCB_FOOTPRINTS\Altium_Footprint_Lib.PcbLib
U54 = SN74LVC1G08DBVRE4_SOT23-5: IC SINGLE 2-INPUT POSITIVE AND GATE SOT23-5; Mistral Part No: 141009060026-R; Mfr_name: TEXAS INSTRUMENTS; Part_type: ICS\DIGITAL\GATES; Project: KHAN_MAIN; Customs_HS_Code: 85423100; Custom_Duty: 15%; PCB Footprint: SOT23-5; Mfr_part_number: SN74LVC1G08DBVRE4; Package: SOT23-5; Distributor_name: DIGIKEY; Distributor_part_number: SN74LVC1G08DBVRE4-ND; Library Ref: SN74LVC1G08DBVRE4_SOT23-5; Height: 1.45MM; Temperature: -40癈+85癈; Datasheet: Y:\MIS_DATABASE\DATASHEETS\ICS\DIGITAL\GATES\SN74LVC1G08.PDF; Crtd /date: USMAN/151008; Chkd/date: SUHAS/221010; RoHS: Sb/ Br FREE
U86 = SN74LVC1G11DCKR_SC70-6: IC SINGLE 3-INPUT POSITIVE-AND GATE SC70-6; Mistral Part No: 141009030230-R; Mfr_name: TEXAS INSTRUMENTS; Part_type: ICS\DIGITAL\GATES; Project: VOCERA; Customs_HS_Code: 85423100; Custom_Duty: 15%; Library Ref: SN74LVC1G11DCKR_SC70-6; Mfr_part_number: SN74LVC1G11DCKR; Package: SC70-6; Distributor_name: DIGIKEY; Distributor_part_number: 296-18066-1-ND; Height: 1.10MM; Datasheet: Y:\MIS_DATABASE\DATASHEETS\ICS\DIGITAL\GATES\SN74LVC1G.PDF; Crtd /date: MAZHAR/150506; Chkd/date: SHREESHAIL/220506; RoHS: Sb/ Br FREE; PCB Footprint: SC70-6